# Altium schematic sheet NMT_SPI_MUX.SCHDOC
size A4; Organization: Altium Limited; Address1: L3, 12a Rodborough Rd; Address2: Frenchs Forest; Address3: NSW; Address4: Australia 2086; DocumentNumber: 7; SheetNumber: 7; SheetTotal: 13
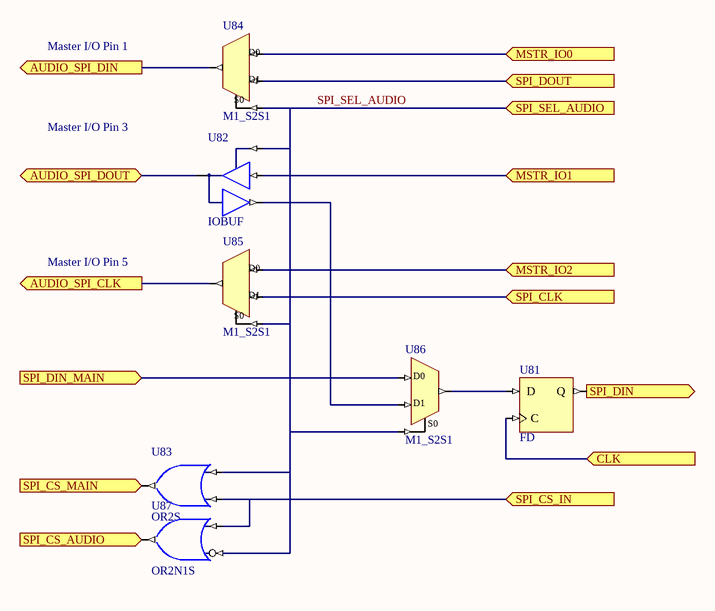
[diagram p0: NMT_SPI_MUX.SCHDOC]

## Parts
U81  FD
U82  IOBUF
U83  OR2S
U84  M1_S2S1
U85  M1_S2S1
U86  M1_S2S1
U87  OR2N1S

## Ports
AUDIO_SPI_CLK (out), AUDIO_SPI_DIN (out), AUDIO_SPI_DOUT (bidir), CLK (in), MSTR_IO0 (in), MSTR_IO1 (in), MSTR_IO2 (in), SPI_CLK (in), SPI_CS_AUDIO (out), SPI_CS_IN (in), SPI_CS_MAIN (out), SPI_DIN (out), SPI_DIN_MAIN (in), SPI_DOUT (in), SPI_SEL_AUDIO (in)

## Nets
AUDIO_SPI_CLK: U85.O ; port AUDIO_SPI_CLK
AUDIO_SPI_DIN: U84.O ; port AUDIO_SPI_DIN
AUDIO_SPI_DOUT: U82.IO ; port AUDIO_SPI_DOUT
CLK: U81.C ; port CLK
MSTR_IO0: U84.D0 ; port MSTR_IO0
MSTR_IO1: U82.I ; port MSTR_IO1
MSTR_IO2: U85.D0 ; port MSTR_IO2
SPI_CLK: U85.D1 ; port SPI_CLK
SPI_CS_AUDIO: U87.O ; port SPI_CS_AUDIO
SPI_CS_IN: U83.I0 U87.I1 ; port SPI_CS_IN
SPI_CS_MAIN: U83.O ; port SPI_CS_MAIN
SPI_DIN: U81.Q ; port SPI_DIN
SPI_DIN_MAIN: U86.D0 ; port SPI_DIN_MAIN
SPI_DOUT: U84.D1 ; port SPI_DOUT
SPI_SEL_AUDIO: U82.T U83.I1 U84.S0 U85.S0 U86.S0 U87.I0 ; port SPI_SEL_AUDIO
NetU81_D: U81.D U86.O
NetU82_O: U82.O U86.D1

## Notes on the sheet
- Master I/O Pin 1
- Master I/O Pin 3
- Master I/O Pin 5
- Title
- Size:
- Date:
- A4
- Number:
- Time:
- Revision:
- Sheet
- of
- File:

## Library data of the parts
U81 = FD: D-Type Flip-Flop; ArchiveName: GENERIC; Published: 18-Dec-2003; Publisher: Altium Limited; Xilinx Equivalent: FD; Core Revision: 1.00.00
U82 = IOBUF: Input/Output Buffer; ArchiveName: GENERIC; Published: 4-Dec-2003; Publisher: Altium Limited; Xilinx Equivalent: IOBUF; Core Revision: 1.00.00
U83 = OR2S: 2-Input OR Gate, Single Pin Version; Xilinx Equivalent: OR2; ArchiveName: GENERIC; Published: 4-Dec-2003; Publisher: Altium Limited; Core Revision: 1.00.00
U84-U86 = M1_S2S1: 2x1-Single Wire to 1x1-Single Wire Multiplexer; Xilinx Equivalent: M2_1; ArchiveName: GENERIC; Published: 4-Dec-2003; Publisher: Altium Limited; Core Revision: 1.00.00
U87 = OR2N1S: 2-Input OR Gate with Active Low A Input, Single Pin Version; Xilinx Equivalent: OR2B1; ArchiveName: GENERIC; Published: 4-Dec-2003; Publisher: Altium Limited; Core Revision: 1.00.00